# Altium schematic sheet nRF24LE1F16Q32.SchDoc: nRF24LE1F16Q32
size A4; Revision: 1.0; SheetNumber: 1; SheetTotal: 1; DrawnBy: KJO
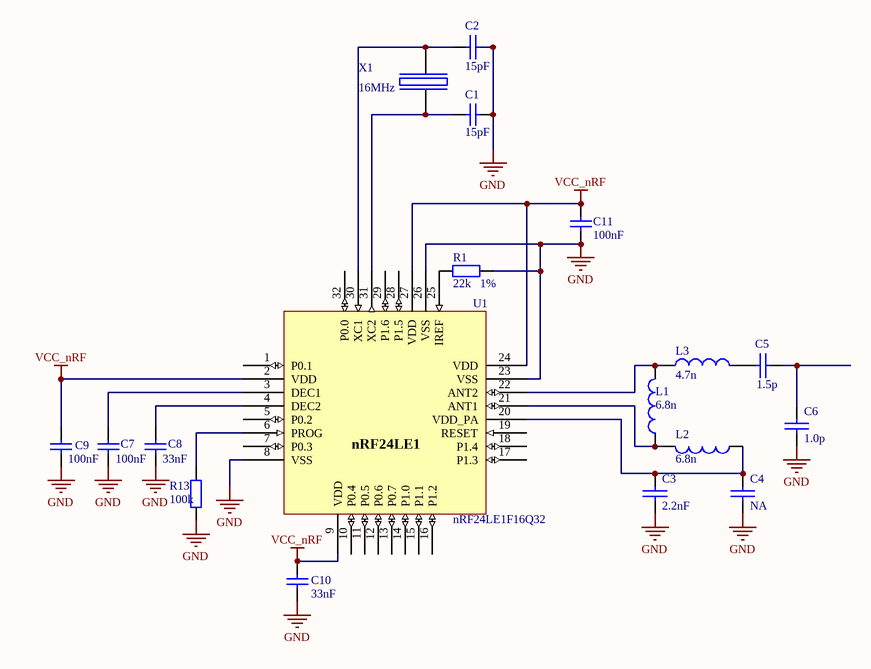
[diagram p0: nRF24LE1F16Q32.SchDoc]

## Parts
C1  value 15pF  [0402s]  (hidden comment: NP0 50V)
C2  value 15pF  [0402s]  (hidden comment: NP0 50V)
C3  value 2.2nF  [0402s]  (hidden comment: X7R 16V)
C4  value NA  [0402s]  (hidden comment: NP0 50V)
C5  value 1.5p  [0402s]  (hidden comment: NP0 +/-0.1pF, 50V)
C6  value 1.0p  [0402s]  (hidden comment: NP0 +/-0.1pF, 50V)
C7  value 100nF  [0402s]  (hidden comment: X7R 16V)
C8  value 33nF  [0402s]  (hidden comment: X7R 16V)
C9  value 100nF  [0402s]  (hidden comment: X7R 16V)
C10  value 33nF  [0402s]  (hidden comment: X7R 16V)
C11  value 100nF  [0402s]  (hidden comment: X7R 16V)
L1  value 6.8n  [0402s]  (hidden comment: Murata LQP15MN6N8B02D)
L2  value 6.8n  [0402s]  (hidden comment: Murata LQP15MN6N8B02D)
L3  value 4.7n  [0402s]  (hidden comment: Murata LQP15MN4N7B02D)
R1  1%  value 22k  [0402s]
R13  value 100k  [0402s]
U1  value nRF24LE1F16Q32  [Nordic_QFN50P500X500X90-33N]  (hidden comment: QFN32 5x5 package)
X1  value 16MHz  [bt-xtal 3225]  (hidden comment: TSX-3225, 16MHz, Cl=9pF, +/-10ppm)

## Nets
GND: C1.1 C2.1 C3.1 C4.1 C6.2 C7.1 C8.1 C9.1 C10.1 C11.2 R1.2 R13.1 U1.8(VSS) U1.23(VSS) U1.26(VSS) X1.2(GND) X1.4(GND)
VCC_nRF: C9.2 C10.2 C11.1 U1.2(VDD) U1.9(VDD) U1.24(VDD) U1.27(VDD)
NetC1_2: C1.2 U1.31(XC2) X1.1(inp)
NetC2_2: C2.2 U1.30(XC1) X1.3(out)
NetC3_2: C3.2 C4.2 L2.1 U1.20(VDD_PA)
NetC5_1: C5.1 C6.1
NetC5_2: C5.2 L3.2
NetC7_2: C7.2 U1.3(DEC1)
NetC8_2: C8.2 U1.4(DEC2)
NetL1_1: L1.1 L2.2 U1.21(ANT1)
NetL1_2: L1.2 L3.1 U1.22(ANT2)
NetR1_1: R1.1 U1.25(IREF)
NetR13_2: R13.2 U1.6(PROG)

Not connected (* = marked no-connect by the designer): U1 1(P0.1) 5(P0.2) 7(P0.3) 10(P0.4) 11(P0.5) 12(P0.6) 13(P0.7) 14(P1.0) 15(P1.1) 16(P1.2) 17(P1.3) 18(P1.4) 19(RESET) 28(P1.5) 29(P1.6) 32(P0.0)

## Notes on the sheet
- Title
- Size
- Date:
- Project Number
- Sheet         of
- Revision
- File:
- Drawn By:
- (in symbol nRF24LE1 - 5x5) nRF24LE1

## Library data of the parts
C1 C7-C11 = Cap: Capacitor; Published: 8-Jun-2000; LatestRevisionDate: 17-Jul-2002; LatestRevisionNote: Re-released for DXP Platform.; PackageReference: RAD-0.3; Publisher: Altium Limited
C2-C6 = Cap: Capacitor; Part Field 1: 0402
L1-L3 = Inductor: Code_IEC: 1005; Published: 8-Jun-2000; LatestRevisionDate: 17-Jul-2002; LatestRevisionNote: Re-released for DXP Platform.; PackageReference: 0402-A; Publisher: Altium Limited; Code_JEITA: 0402
R1 R13 = Res2: Resistor; Published: 8-Jun-2000; LatestRevisionDate: 17-Jul-2002; LatestRevisionNote: Re-released for DXP Platform.; PackageReference: AXIAL-0.4; Publisher: Altium Limited
U1 = nRF24LE1 - 5x5: 2.4GHz Tranceiver with embedded MCU and 10 bit ADC
X1 = BT-XTAL: Crystal